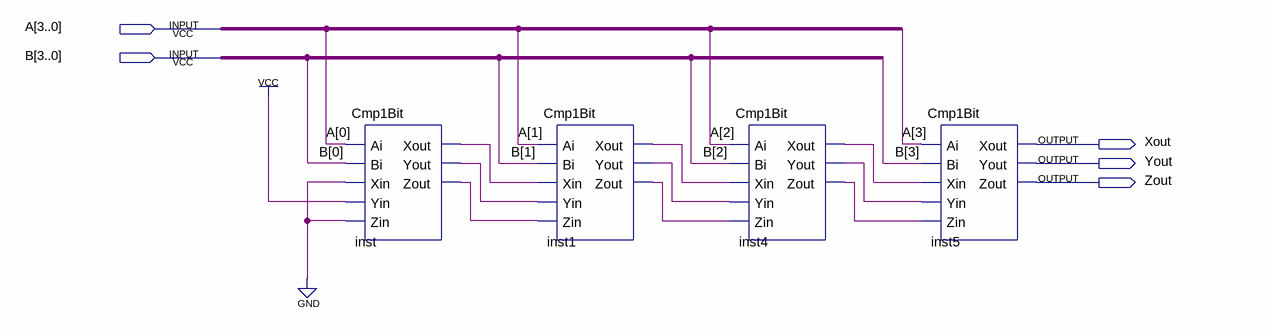
[diagram p0: schematic sheet]
// Quartus schematic Cmp4bit.bdf as structural Verilog: 4 symbols, 5 pins
module Cmp4bit (
  input  [3:0] A,
  input  [3:0] B,
  output Xout,
  output Yout,
  output Zout
);

  wire inst1_xout, inst1_yout, inst1_zout, inst4_xout, inst4_yout, inst4_zout, inst_xout, inst_yout,
       inst_zout;

  Cmp1Bit inst (
    .Ai(A[0]), .Bi(B[0]), .Xin(1'b0), .Yin(1'b1), .Zin(1'b0), .Xout(inst_xout), .Yout(inst_yout),
    .Zout(inst_zout));
  Cmp1Bit inst1 (
    .Ai(A[1]), .Bi(B[1]), .Xin(inst_xout), .Yin(inst_yout), .Zin(inst_zout), .Xout(inst1_xout),
    .Yout(inst1_yout), .Zout(inst1_zout));
  Cmp1Bit inst4 (
    .Ai(A[2]), .Bi(B[2]), .Xin(inst1_xout), .Yin(inst1_yout), .Zin(inst1_zout), .Xout(inst4_xout),
    .Yout(inst4_yout), .Zout(inst4_zout));
  Cmp1Bit inst5 (
    .Ai(A[3]), .Bi(B[3]), .Xin(inst4_xout), .Yin(inst4_yout), .Zin(inst4_zout), .Xout(Xout), .Yout(Yout),
    .Zout(Zout));
endmodule
